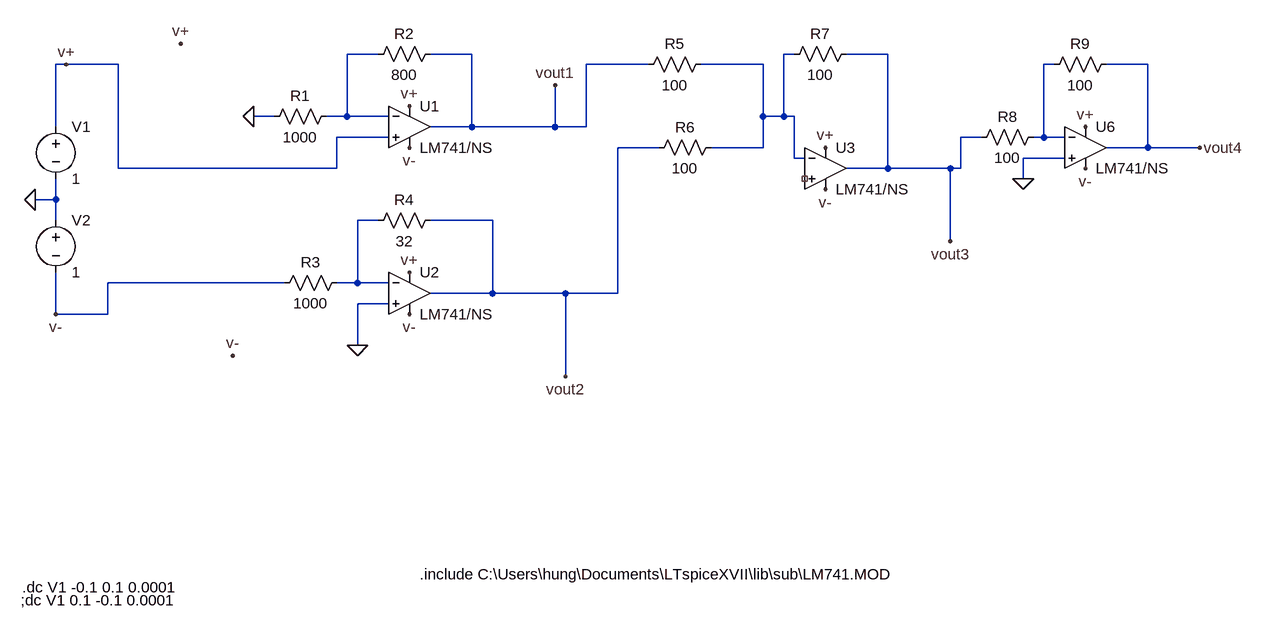
[diagram p0: schematic lab 7 part 5.asc]
lab 7 part 5.asc, the LTspice schematic file:
Version 4
SHEET 1 1700 744
WIRE 352 -112 304 -112
WIRE 496 -112 432 -112
WIRE 992 -112 976 -112
WIRE 1136 -112 1072 -112
WIRE -128 -96 -144 -96
WIRE -48 -96 -128 -96
WIRE 768 -96 672 -96
WIRE 944 -96 848 -96
WIRE 1392 -96 1376 -96
WIRE 1536 -96 1472 -96
WIRE 192 -16 160 -16
WIRE 304 -16 304 -112
WIRE 304 -16 272 -16
WIRE 368 -16 304 -16
WIRE 944 -16 944 -96
WIRE 976 -16 976 -112
WIRE 976 -16 944 -16
WIRE 992 -16 976 -16
WIRE -144 0 -144 -96
WIRE 496 0 496 -112
WIRE 496 0 432 0
WIRE 624 0 624 -64
WIRE 624 0 496 0
WIRE 672 0 672 -96
WIRE 672 0 624 0
WIRE 368 16 288 16
WIRE 1280 16 1248 16
WIRE 1376 16 1376 -96
WIRE 1376 16 1360 16
WIRE 1408 16 1376 16
WIRE 784 32 720 32
WIRE 944 32 944 -16
WIRE 944 32 864 32
WIRE 1536 32 1536 -96
WIRE 1536 32 1472 32
WIRE 1616 32 1536 32
WIRE 992 48 992 -16
WIRE 1008 48 992 48
WIRE 1408 48 1344 48
WIRE -48 64 -48 -96
WIRE 288 64 288 16
WIRE 288 64 -48 64
WIRE 1136 64 1136 -112
WIRE 1136 64 1072 64
WIRE 1232 64 1136 64
WIRE 1248 64 1248 16
WIRE 1248 64 1232 64
WIRE 1344 80 1344 48
WIRE -144 112 -144 80
WIRE -144 112 -176 112
WIRE -144 144 -144 112
WIRE 352 144 320 144
WIRE 528 144 432 144
WIRE 1232 176 1232 64
WIRE 208 240 -64 240
WIRE 320 240 320 144
WIRE 320 240 288 240
WIRE 368 240 320 240
WIRE 528 256 528 144
WIRE 528 256 432 256
WIRE 640 256 528 256
WIRE 720 256 720 32
WIRE 720 256 640 256
WIRE 368 272 320 272
WIRE -144 288 -144 224
WIRE -64 288 -64 240
WIRE -64 288 -144 288
WIRE 320 336 320 272
WIRE 640 384 640 256
FLAG -176 112 0
FLAG -128 -96 v+
FLAG 400 -32 v+
FLAG 400 32 v-
FLAG -144 288 v-
FLAG 160 -16 0
FLAG 48 -128 v+
FLAG 624 -64 vout1
FLAG 400 224 v+
FLAG 400 288 v-
FLAG 128 352 v-
FLAG 640 384 vout2
FLAG 320 336 0
FLAG 1040 32 v+
FLAG 1040 96 v-
FLAG 1232 176 vout3
FLAG 1440 0 v+
FLAG 1440 64 v-
FLAG 1616 32 vout4
FLAG 1344 80 0
SYMBOL voltage -144 -16 R0
WINDOW 123 0 0 Left 0
WINDOW 39 0 0 Left 0
SYMATTR InstName V1
SYMATTR Value 1
SYMBOL voltage -144 128 R0
WINDOW 123 0 0 Left 0
WINDOW 39 0 0 Left 0
SYMATTR InstName V2
SYMATTR Value 1
SYMBOL Opamps\\opamp2 400 -64 R0
SYMATTR InstName U1
SYMATTR Value LM741/NS
SYMBOL res 288 -32 R90
WINDOW 0 0 56 VBottom 2
WINDOW 3 32 56 VTop 2
SYMATTR InstName R1
SYMATTR Value 1000
SYMBOL res 448 -128 R90
WINDOW 0 0 56 VBottom 2
WINDOW 3 32 56 VTop 2
SYMATTR InstName R2
SYMATTR Value 800
SYMBOL Opamps\\opamp2 400 192 R0
SYMATTR InstName U2
SYMATTR Value LM741/NS
SYMBOL res 304 224 R90
WINDOW 0 0 56 VBottom 2
WINDOW 3 32 56 VTop 2
SYMATTR InstName R3
SYMATTR Value 1000
SYMBOL res 448 128 R90
WINDOW 0 0 56 VBottom 2
WINDOW 3 32 56 VTop 2
SYMATTR InstName R4
SYMATTR Value 32
SYMBOL Opamps\\opamp2 1040 0 R0
SYMATTR InstName U3
SYMATTR Value LM741/NS
SYMBOL res 864 -112 R90
WINDOW 0 0 56 VBottom 2
WINDOW 3 32 56 VTop 2
SYMATTR InstName R5
SYMATTR Value 100
SYMBOL res 880 16 R90
WINDOW 0 0 56 VBottom 2
WINDOW 3 32 56 VTop 2
SYMATTR InstName R6
SYMATTR Value 100
SYMBOL res 1088 -128 R90
WINDOW 0 0 56 VBottom 2
WINDOW 3 32 56 VTop 2
SYMATTR InstName R7
SYMATTR Value 100
SYMBOL Opamps\\opamp2 1440 -32 R0
SYMATTR InstName U6
SYMATTR Value LM741/NS
SYMBOL res 1376 0 R90
WINDOW 0 0 56 VBottom 2
WINDOW 3 32 56 VTop 2
SYMATTR InstName R8
SYMATTR Value 100
SYMBOL res 1488 -112 R90
WINDOW 0 0 56 VBottom 2
WINDOW 3 32 56 VTop 2
SYMATTR InstName R9
SYMATTR Value 100
TEXT 416 688 Left 2 !.include C:\\Users\\hung\\Documents\\LTspiceXVII\\lib\\sub\\LM741.MOD
TEXT -196 708 Left 2 !.dc V1 -0.1 0.1 0.0001
TEXT -198 728 Left 2 !;dc V1 0.1 -0.1 0.0001

The netlist it stands for:
* lab 7 part 5.asc
V1 v+ 0 1
V2 0 v- 1
XU1 v+ N001 v+ v- vout1 LM741/NS  ; pins In+ In- V+ V- OUT
R1 N001 0 1000
R2 vout1 N001 800
XU2 0 N004 v+ v- vout2 LM741/NS  ; pins In+ In- V+ V- OUT
R3 N004 v- 1000
R4 vout2 N004 32
XU3 NC_01 N002 v+ v- vout3 LM741/NS  ; pins In+ In- V+ V- OUT
R5 N002 vout1 100
R6 N002 vout2 100
R7 vout3 N002 100
XU6 0 N003 v+ v- vout4 LM741/NS  ; pins In+ In- V+ V- OUT
R8 N003 vout3 100
R9 vout4 N003 100
.include C:\Users\hung\Documents\LTspiceXVII\lib\sub\LM741.MOD
.dc V1 -0.1 0.1 0.0001
;dc V1 0.1 -0.1 0.0001
.backanno
.end